# EAGLE design ZMOD4510 (EAGLE 9.4.1)
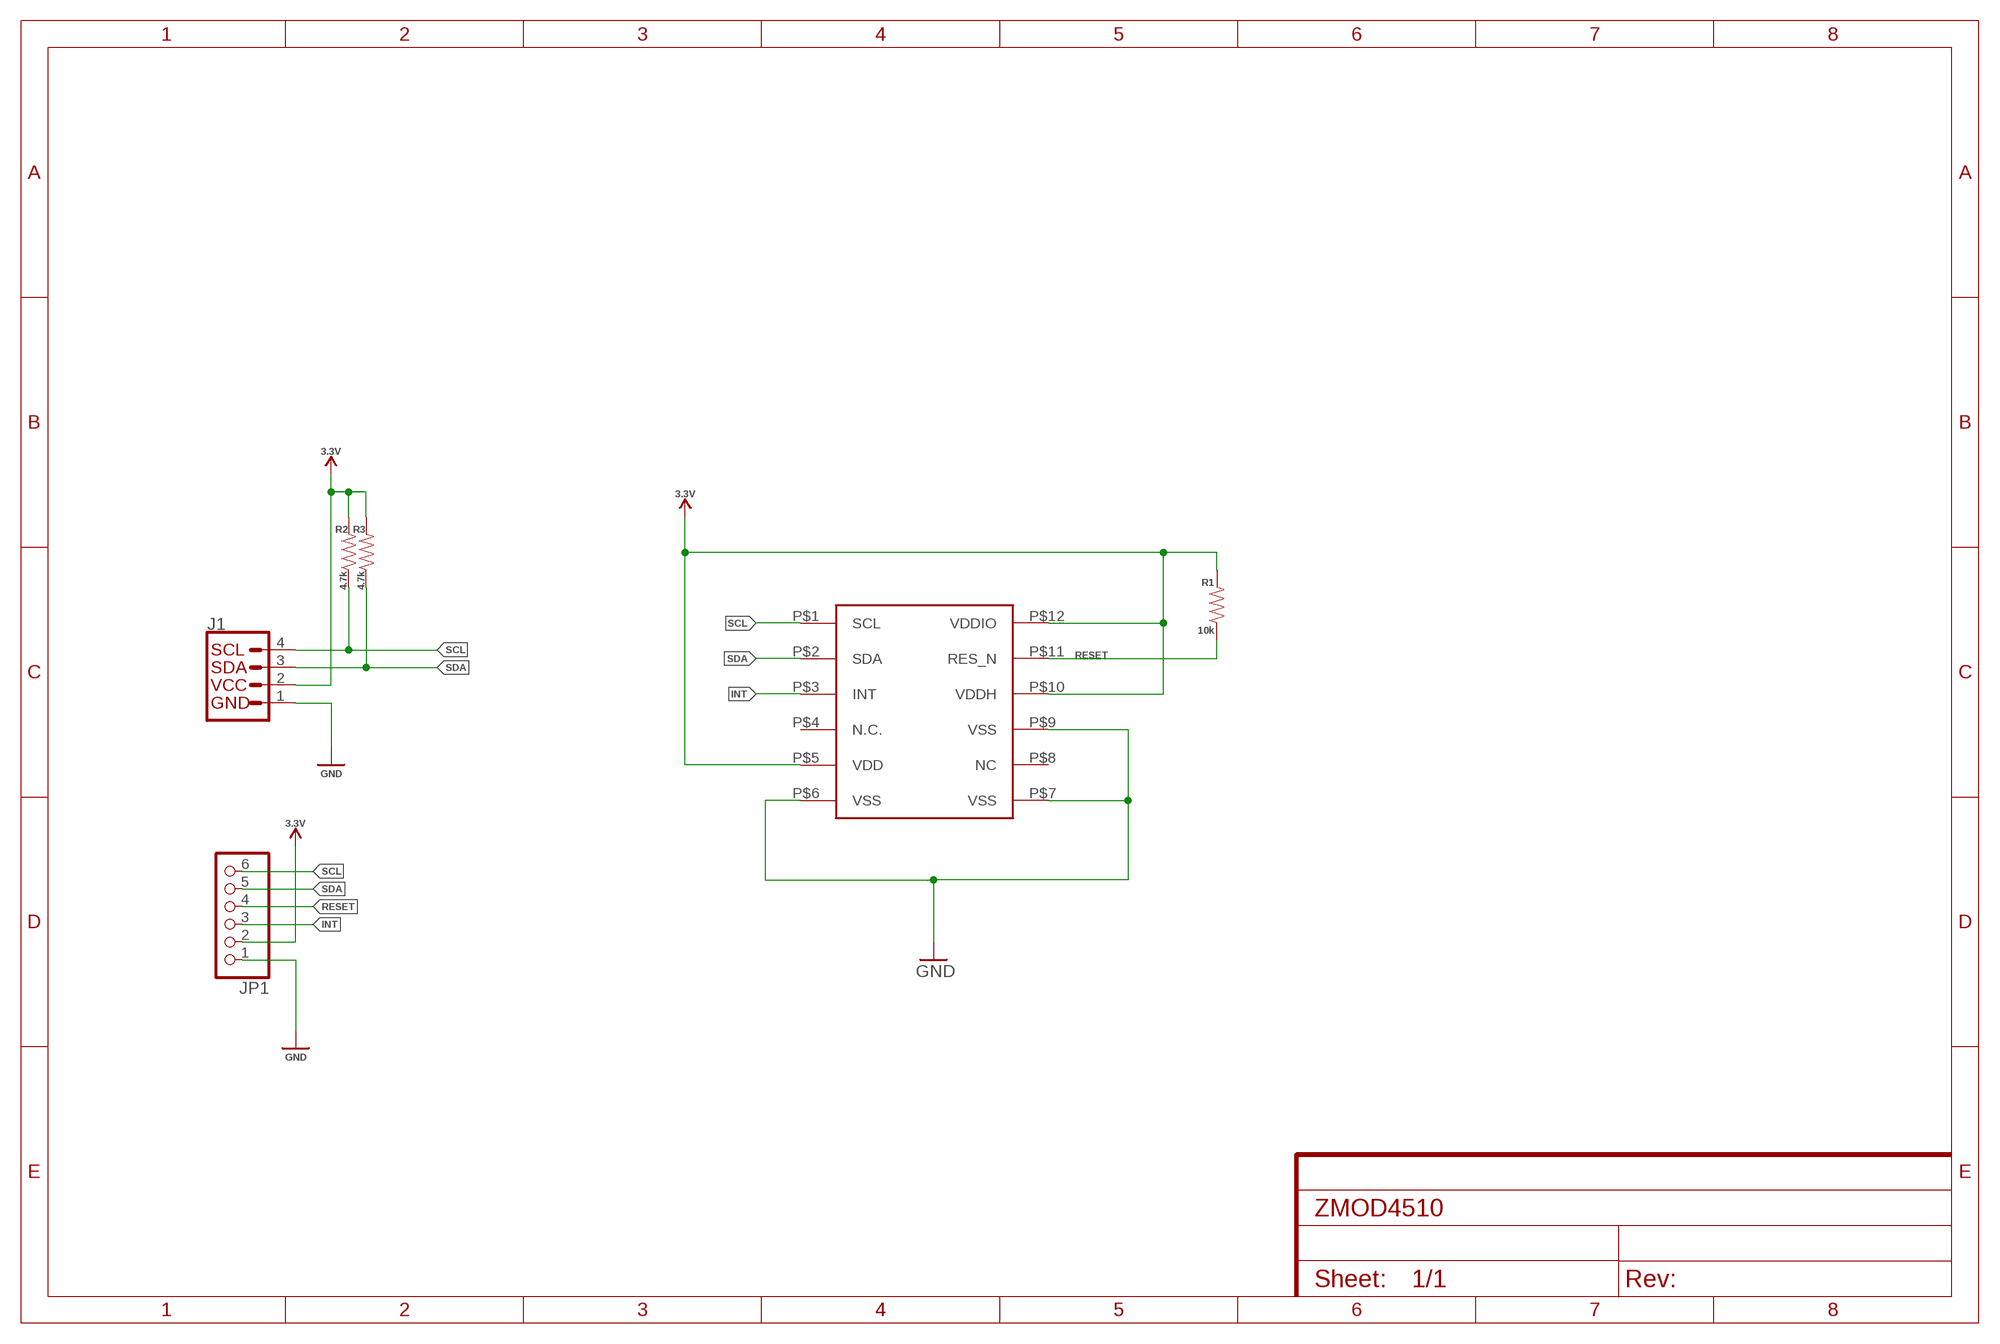
[diagram p0: schematic, sheet 1]

## Parts
J1  QWIIC_CONNECTORJS-1MM  [1X04_1MM_RA]
JP1  PINHD-1X6  [1X06]
R1  10k  10KOHM-0603-1/10W-1%  [0603]
R2  4.7k  4.7KOHM-0603-1/10W-1%  [0603]
R3  4.7k  4.7KOHM-0603-1/10W-1%  [0603]
U1  ZMOD4510  [ZMOD4510]

## Nets
3.3V: J1.2 JP1.2 R1.2 R2.2 R3.2 U1.P$5(VDD) U1.P$10(VDDH) U1.P$12(VDDIO)
GND: J1.1 JP1.1 U1.P$6(VSS) U1.P$7(VSS) U1.P$9(VSS)
INT: JP1.3 U1.P$3(INT)
RESET: JP1.4 R1.1 U1.P$11(RES_N)
SCL: J1.4 JP1.6 R2.1 U1.P$1(SCL)
SDA: J1.3 JP1.5 R3.1 U1.P$2(SDA)
Unconnected: U1.P$4(N.C.) U1.P$8(NC)

## Library data of the parts
J1 = SparkFun-Connectors:QWIIC_CONNECTOR: SparkFun I2C Standard Qwiic Connector An SMD 1mm pitch JST connector makes it easy and quick (get it? Qwiic?) to connect I2C devices to each other. The Qwiic system <http://www.sparkfun.com/qwiic> enables fast and solderless connection between popular platforms and various sensors and actuators. We carry 200mm <https://www.sparkfun.com/products/14204>, 100mm <https://www.sparkfun.com/products/14205>, 50mm <https://www.sparkfun.com/products/14206>, and breadboard friendly <https://www.sparkfun.com/products/14207> Qwiic cables. We also offer 10 pcs strips <https://www.sparkfun.com/products/14323> the SMD connectors.; PROD_ID: CONN-13694
JP1 = adafruit:PINHD-1X6: PIN HEADER
R1 = SparkFun-Resistors:10KOHM: 10kΩ resistor A resistor is a passive two-terminal electrical component that implements electrical resistance as a circuit element. Resistors act to reduce current flow, and, at the same time, act to lower voltage levels within circuits. - Wikipedia; PROD_ID: RES-00824
R2 R3 = SparkFun-Resistors:4.7KOHM: 4.7kΩ resistor A resistor is a passive two-terminal electrical component that implements electrical resistance as a circuit element. Resistors act to reduce current flow, and, at the same time, act to lower voltage levels within circuits. - Wikipedia; PROD_ID: RES-07857
U1 = zmod4510:ZMOD4510

## Board
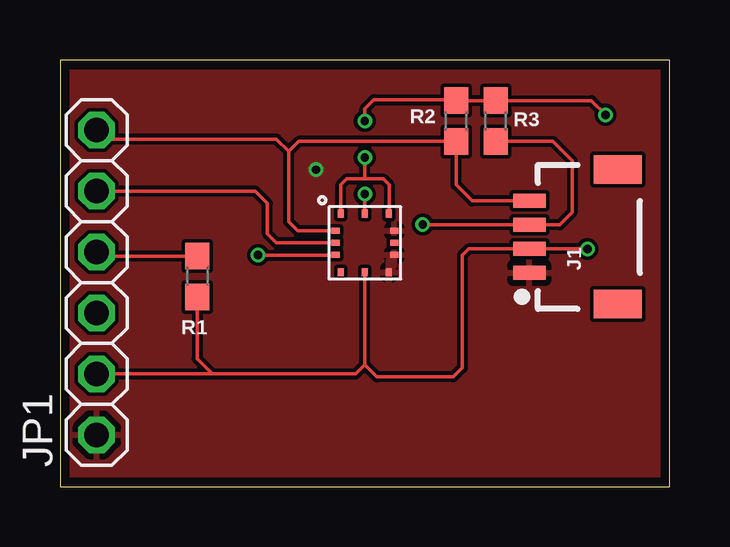
[diagram p1: board, top side]
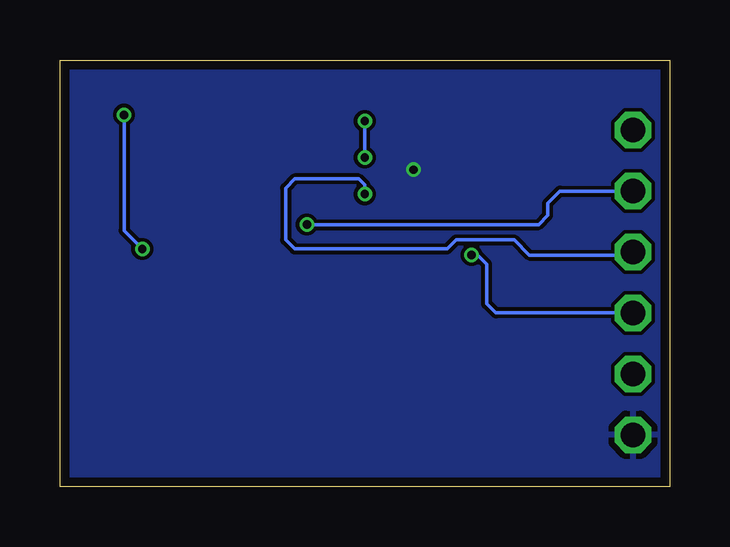
[diagram p2: board, bottom side, seen from below]

Size 25.4 x 17.78 mm. Coordinates in mm from the lower left corner, seen from the top.
Outline: 0,0 25.4,0 25.4,17.78 0,17.78 0,0
Copper layers (1*16): Top 0.035559375mm / dielectric 1.6mm / Bottom 0.035559375mm
Design rules "oshpark-2layer": minimum track width 6mil, minimum drill 10mil, track to track 6mil, track to pad 6mil, pad to pad 6mil, via to via 6mil, smd to smd 6mil, copper to edge 15mil, drill to drill 6mil, minimum pad ring 5mil, minimum via ring 5mil, stop-mask expansion 2.5mil, vias tented up to drill 0mil, thermal gap 10mil

### Footprints (pad centres in the part's own frame; a part is rotated, then mirrored left to right if it is on the bottom)
1X04_1MM_RA = smd 0.6 x 1.35: 1 -1.5,0; 2 -0.5,0; 3 0.5,0; 4 1.5,0 | smd 1.2 x 2: NC1 2.8,-3.675; NC2 -2.8,-3.675
1X06 = drill 1.016 octagon: 1 -6.35,0; 2 -3.81,0; 3 -1.27,0; 4 1.27,0; 5 3.81,0; 6 6.35,0
0603 = smd 1.1 x 1: 1 -0.85,0; 2 0.85,0
ZMOD4510 = smd 0.25 x 0.35: P$1 -0.5,-1.225; P$2 0,-1.225; P$3 0.5,-1.225; P$7 0.5,1.225; P$8 0,1.225; P$9 -0.5,1.225 | smd 0.35 x 0.25: P$4 1.225,-1; P$5 1.225,0; P$6 1.225,1; P$10 -1.225,1; P$11 -1.225,0; P$12 -1.225,-1

### Placement (x,y rotation side)
J1  19.56,10.41 90 top
JP1  1.52,8.51 90 top
R1  5.71,8.76 270 top
R2  16.51,15.24 90 top
R3  18.16,15.24 90 top
U1  12.7,10.16 270 top

### Tracks (layer width: path | path; a pad name or v marks a point on that pad's centre or on a via)
3.3V  (via drill 0.35)
  Top 0.152: JP1.2 6.35,4.7 | 6.35,4.7 12.32,4.7 12.7,5.08 | 12.7,5.08 U1.P$5 | 12.7,5.08 13.21,4.57 16.38,4.57 16.76,4.95 16.76,9.65 17.03,9.91 J1.2 v21.97,9.91 | R1.2 5.71,5.33 6.35,4.7 | U1.P$12 11.7,12.59 11.94,12.83 12.7,12.83 | U1.P$10 13.72,11.4 13.72,12.57 13.46,12.83 12.7,12.83 | v12.7,15.24 12.7,15.75 13.08,16.13 16.47,16.13 R2.2 R3.2 22.14,16.09 v22.73,15.49 | 12.7,12.83 v12.7,13.72
  Bottom 0.152: v12.7,13.72 v12.7,15.24 | v22.73,15.49 22.73,10.67 v21.97,9.91
GND  (via drill 0.35)
  other vias: 10.67,13.21
  pour Top (rank 6): 0,0 25.4,0 25.4,17.78 0,17.78
  pour Bottom (rank 6): 0,0 0,17.78 25.4,17.78 25.4,0
INT  (via drill 0.35)
  Top 0.152: v8.26,9.65 U1.P$3
  Bottom 0.152: JP1.3 7.24,7.24 7.62,7.62 7.62,9.27 8,9.65 v8.26,9.65
RESET  (via drill 0.35)
  Top 0.152: R1.1 1.69,9.61 JP1.4 | U1.P$11 v12.7,12.19
  Bottom 0.152: v12.7,12.19 12.7,12.57 12.95,12.83 15.62,12.83 16,12.45 16,10.29 15.62,9.91 9.27,9.91 8.89,10.29 6.48,10.29 5.84,9.65 1.65,9.65 JP1.4
SCL
  Top 0.152: U1.P$1 9.91,10.66 9.53,11.05 9.53,13.97 | J1.4 17.17,11.91 16.51,12.57 R2.1 9.95,14.39 9.53,13.97 | 9.53,13.97 9.02,14.48 1.91,14.48 JP1.6
SDA  (via drill 0.35)
  Top 0.152: U1.P$2 9.02,10.16 8.64,10.54 8.64,11.81 8.13,12.32 JP1.5 | v15.11,10.92 15.12,10.91 J1.3 20.82,10.91 21.34,11.43 21.34,13.59 20.54,14.39 R3.1
  Bottom 0.152: v15.11,10.92 5.46,10.92 5.08,11.3 5.08,11.81 4.57,12.32 JP1.5